# Altium schematic sheet lcdcontroll.SchDoc
size 297 x 209 mm
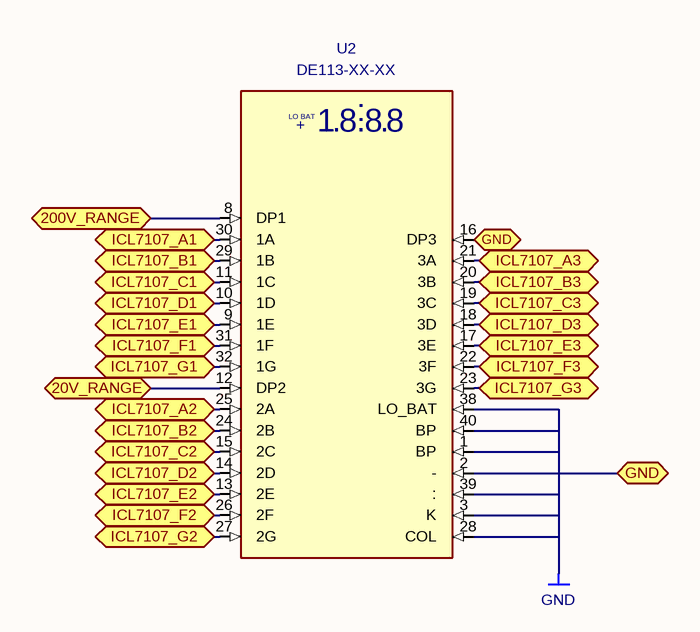
[diagram p0: lcdcontroll.SchDoc]

## Parts
#1  GND
U2  DE113-XX-XX  [DE113-XX-XX]

## Ports
20V_RANGE (bidir), 200V_RANGE (bidir), GND (bidir), ICL7107_A1 (bidir), ICL7107_A2 (bidir), ICL7107_A3 (bidir), ICL7107_B1 (bidir), ICL7107_B2 (bidir), ICL7107_B3 (bidir), ICL7107_C1 (bidir), ICL7107_C2 (bidir), ICL7107_C3 (bidir), ICL7107_D1 (bidir), ICL7107_D2 (bidir), ICL7107_D3 (bidir), ICL7107_E1 (bidir), ICL7107_E2 (bidir), ICL7107_E3 (bidir), ICL7107_F1 (bidir), ICL7107_F2 (bidir), ICL7107_F3 (bidir), ICL7107_G1 (bidir), ICL7107_G2 (bidir), ICL7107_G3 (bidir)

## Nets
20V_RANGE: U2.12(DP2) ; port 20V_RANGE
200V_RANGE: U2.8(DP1) ; port 200V_RANGE
GND: U2.1(BP) U2.2(-) U2.3(K) U2.16(DP3) U2.28(COL) U2.38(LO_BAT) U2.39(:) U2.40(BP) ; port GND
ICL7107_A1: U2.30(1A) ; port ICL7107_A1
ICL7107_A2: U2.25(2A) ; port ICL7107_A2
ICL7107_A3: U2.21(3A) ; port ICL7107_A3
ICL7107_B1: U2.29(1B) ; port ICL7107_B1
ICL7107_B2: U2.24(2B) ; port ICL7107_B2
ICL7107_B3: U2.20(3B) ; port ICL7107_B3
ICL7107_C1: U2.11(1C) ; port ICL7107_C1
ICL7107_C2: U2.15(2C) ; port ICL7107_C2
ICL7107_C3: U2.19(3C) ; port ICL7107_C3
ICL7107_D1: U2.10(1D) ; port ICL7107_D1
ICL7107_D2: U2.14(2D) ; port ICL7107_D2
ICL7107_D3: U2.18(3D) ; port ICL7107_D3
ICL7107_E1: U2.9(1E) ; port ICL7107_E1
ICL7107_E2: U2.13(2E) ; port ICL7107_E2
ICL7107_E3: U2.17(3E) ; port ICL7107_E3
ICL7107_F1: U2.31(1F) ; port ICL7107_F1
ICL7107_F2: U2.26(2F) ; port ICL7107_F2
ICL7107_F3: U2.22(3F) ; port ICL7107_F3
ICL7107_G1: U2.32(1G) ; port ICL7107_G1
ICL7107_G2: U2.27(2G) ; port ICL7107_G2
ICL7107_G3: U2.23(3G) ; port ICL7107_G3

Not connected (* = marked no-connect by the designer): #1 1(GND); U2 4(NC) 5(NC) 6(NC) 7(NC) 33(NC) 34(NC) 35(NC) 36(NC) 37(NC)

## Notes on the sheet
- 1
- 2
- 3
- 4
- 5
- 6
- A
- B
- C
- D
- Title:
- File: lcdcontroll.kicad_sch
- Sheet: /
- KiCad E.D.A.  kicad (5.1.4)-1
- Size: A4
- Date:
- Rev:
- Id: 1/1
- (in symbol DE113-XX-XX) LO BAT; +; .

## Library data of the parts
#1 = GND: Value: GND
U2 = DE113-XX-XX: Value: DE113-XX-XX; Footprint: Display_7Segment:DE113-XX-XX